# EAGLE design Pulse Oximeter (EAGLE 7.5.0)
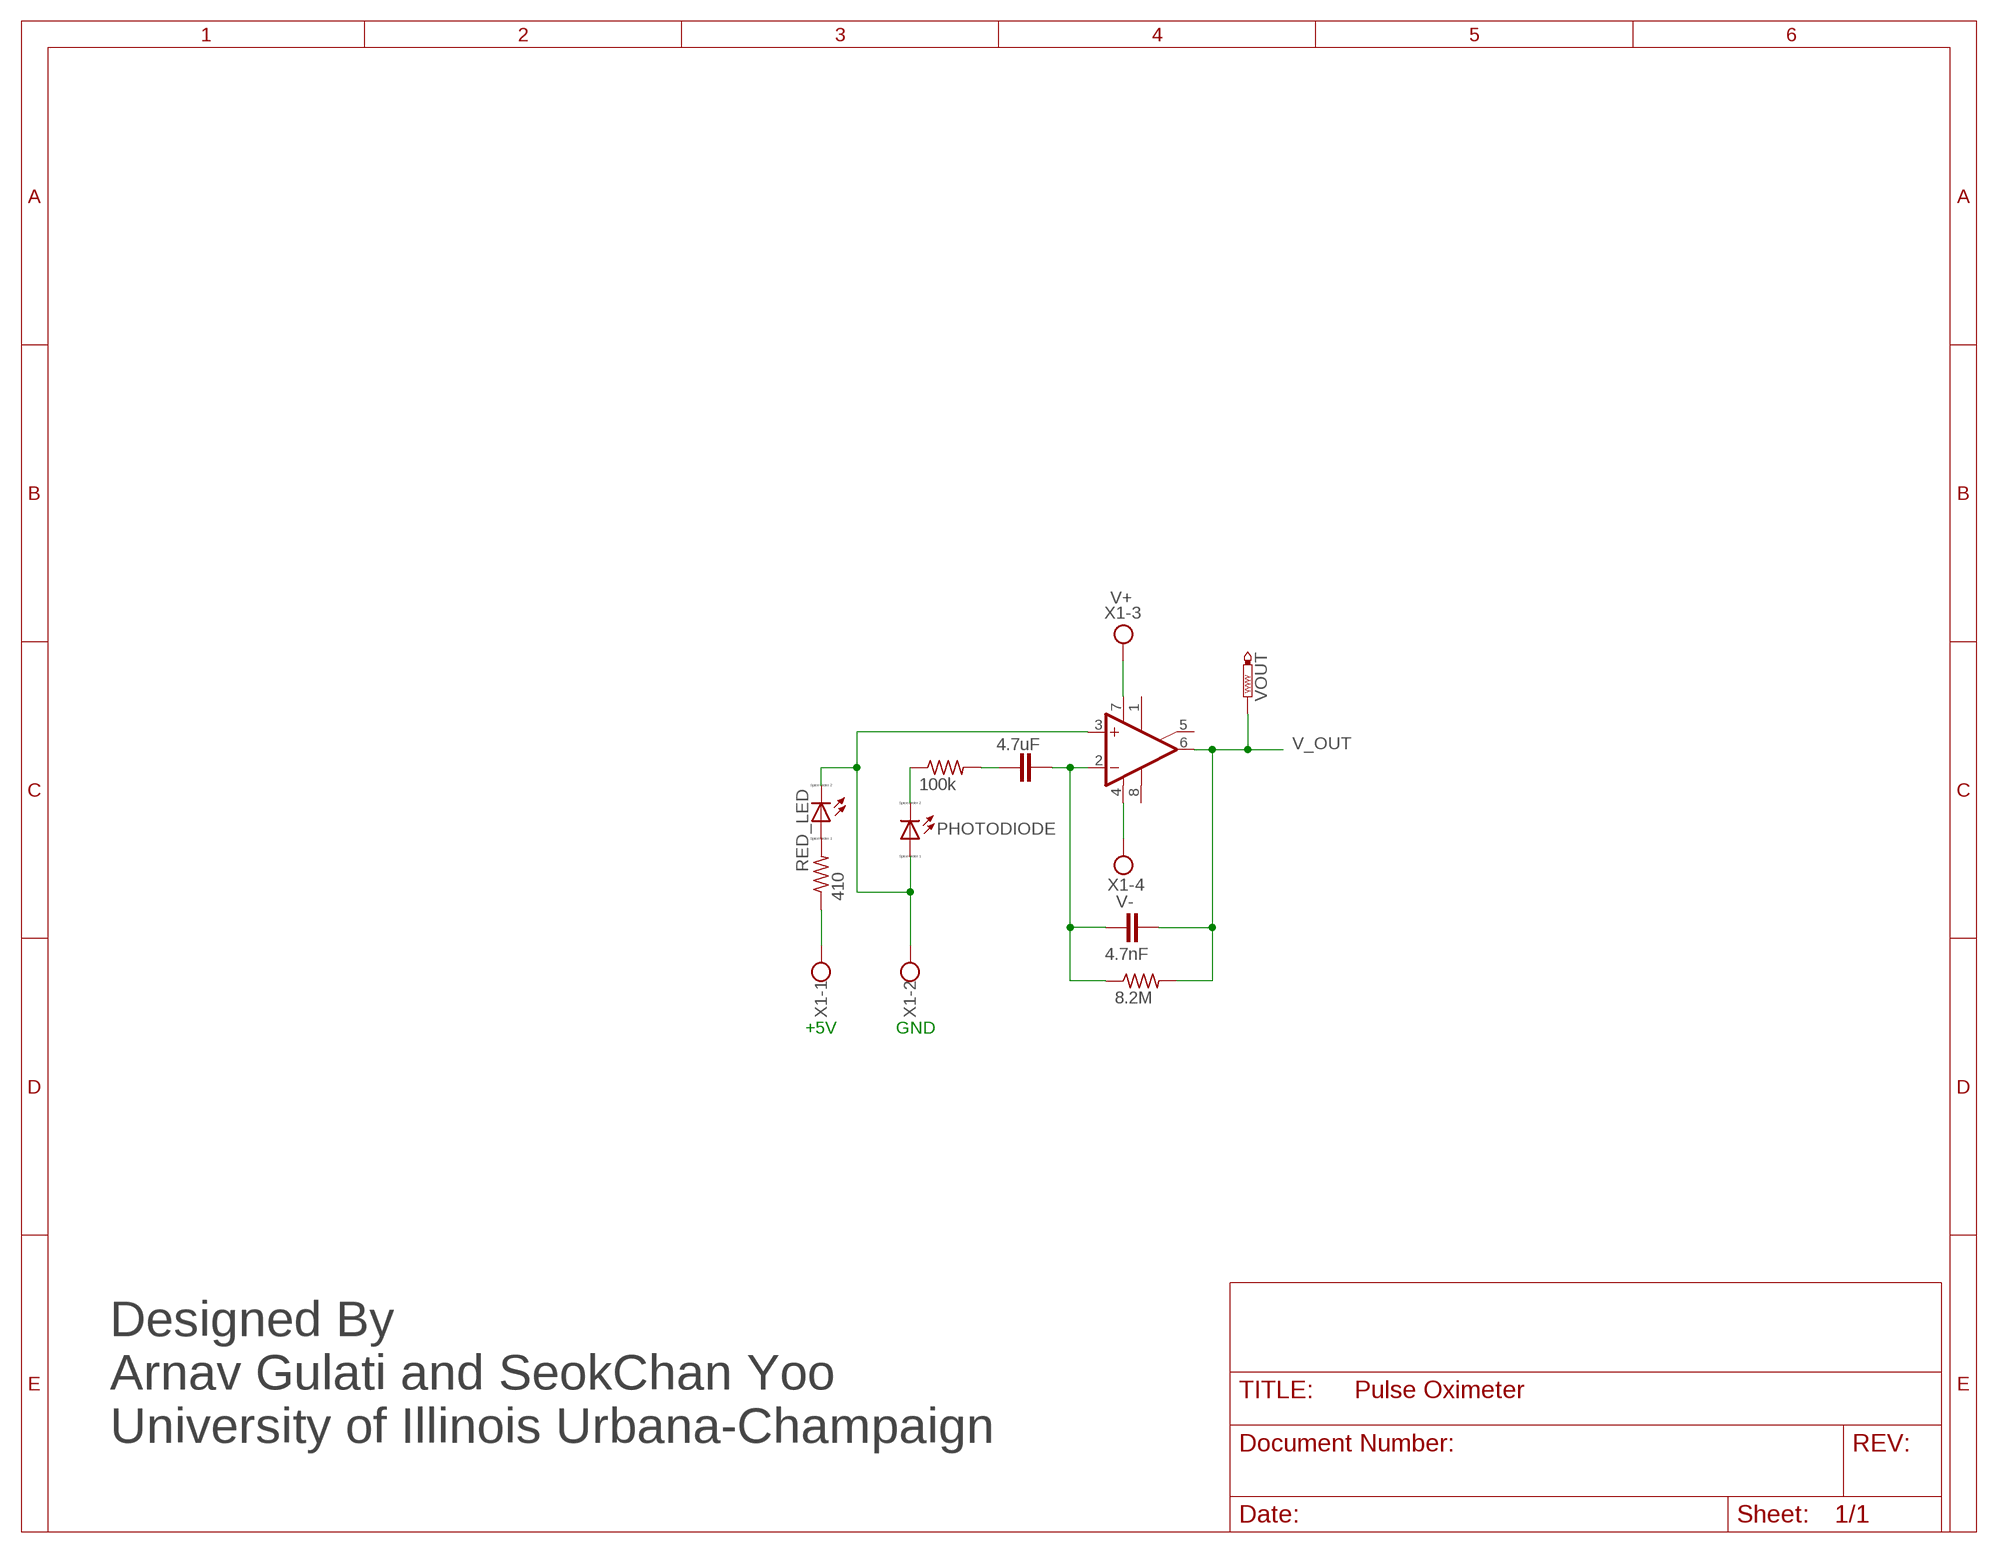
[diagram p0: schematic, sheet 1]
FRAME1 (FRAME_A_L): TITLE: Simple Pulse Oximeter

## Parts
C1  4.7uF  C2,5-3  [C2.5-3]
C2  4.7nF  C2,5-3  [C2.5-3]
IC1  LM741P  [DIL08]
PHOTODIODE  LED_ELD260  [LED_LD260]
R1  100k  R-US_0204/5  [0204/5]
R2  8.2M  R-US_0204/5  [0204/5]
R3  410  R-US_0204/5  [0204/5]
RED_LED  LED_ELD260  [LED_LD260]
VOUT  PTR1PAD1-13  [P1-13]
X1  W237-4  [W237-4]

## Nets
N$1: R3.1 X1.1
N$2: IC1.3(+IN) PHOTODIODE.A RED_LED.K(C) X1.2
N$4: C1.2 C2.1 IC1.2(-IN) R2.1
N$5: C1.1 R1.2
N$6: PHOTODIODE.K(C) R1.1
N$7: R3.2 RED_LED.A
V+: IC1.7(V+) X1.3
V-: IC1.4(V-) X1.4
V_OUT: C2.2 IC1.6(OUT) R2.2 VOUT.TP
Unconnected: IC1.1(ON1) IC1.5(ON2) IC1.8(OPT)

## Notes on the sheet
- +5V | GND
- Designed By
- Arnav Gulati and SeokChan Yoo
- University of Illinois Urbana-Champaign

## Library data of the parts
C1 C2 = capacitor-wima:C: CAPACITOR naming: grid - package width
IC1 = linear:*741: OP AMP
PHOTODIODE RED_LED = eagle-ltspice:LED_E: LED Source: http://www.osram.convergy.de Source: www.luxeon.com Source: www.kingbright.com; SPICEMODEL: NONE; SPICEPREFIX: D; SPICETYPE: diode
R1-R3 = rcl:R-US_: RESISTOR, American symbol
VOUT = testpad:PTR1: TEST PIN
X1 = con-wago-500:W237-4: WAGO SCREW CLAMP; OC_FARNELL: unknown; OC_NEWARK: unknown

## Board
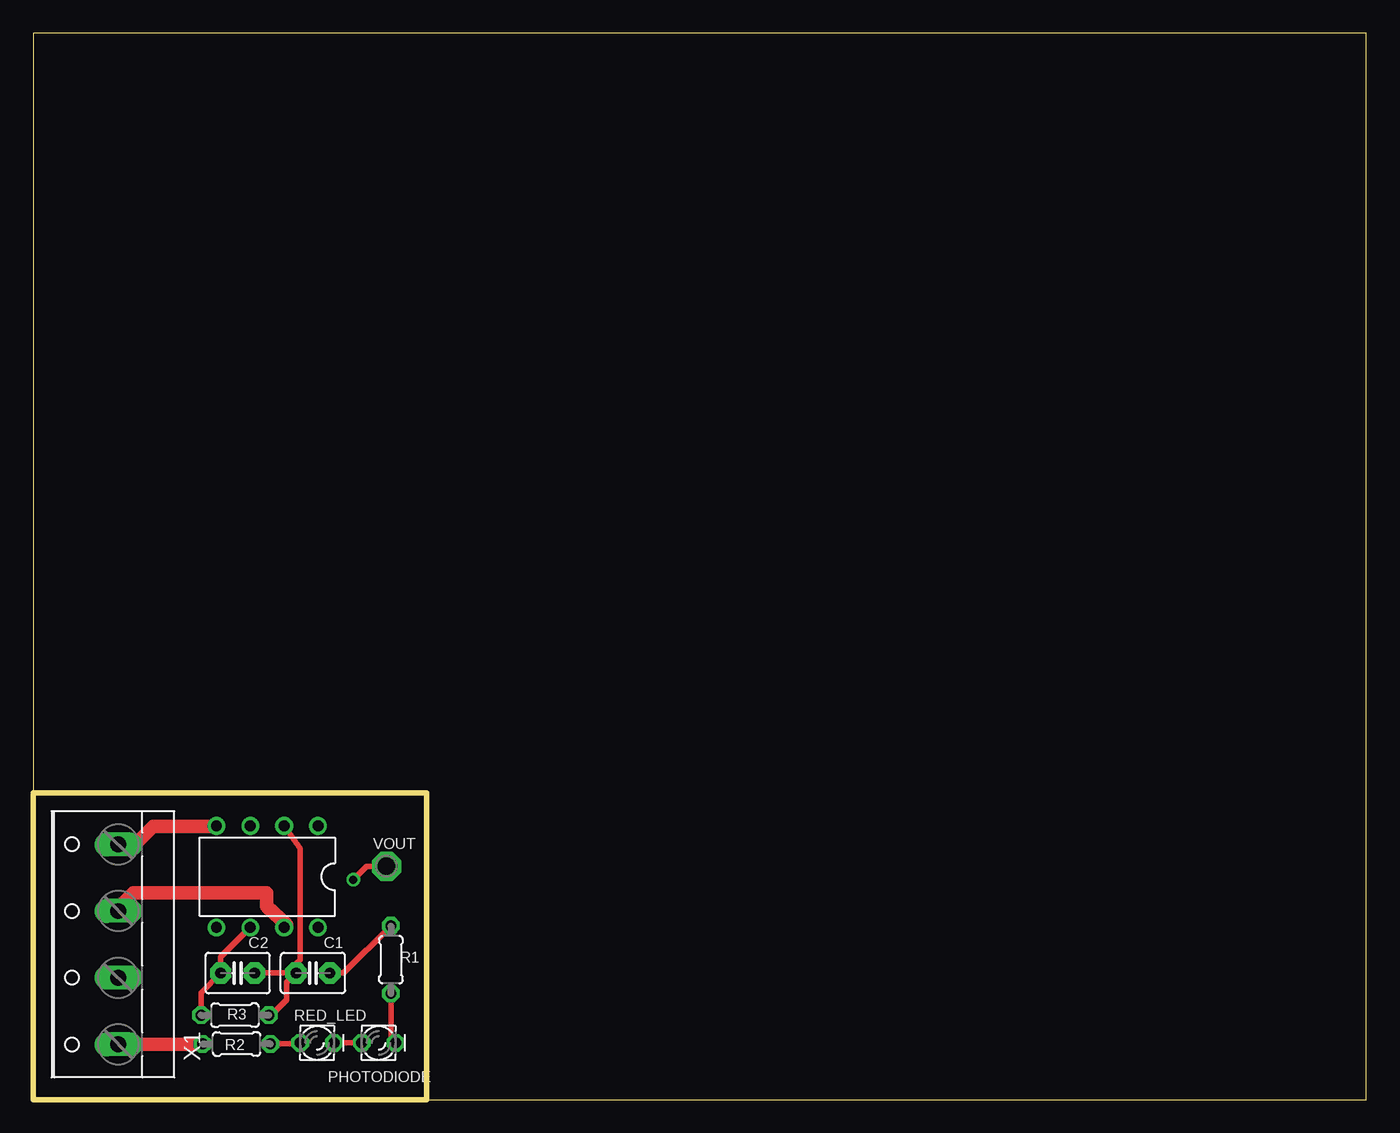
[diagram p1: board, top side]
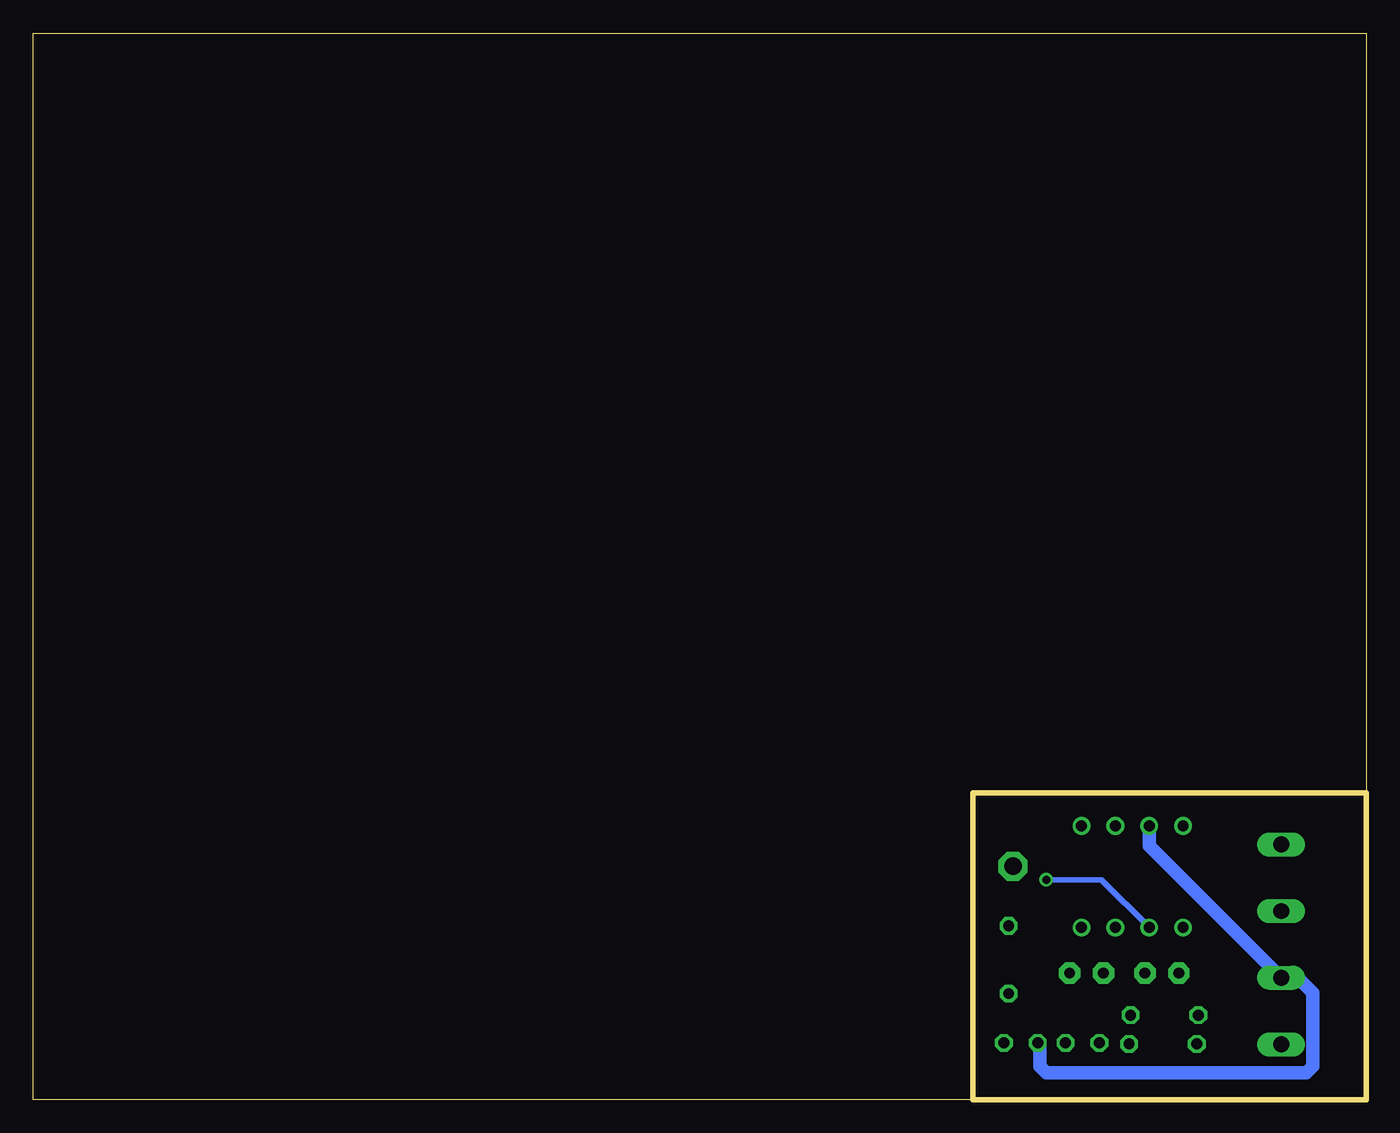
[diagram p2: board, bottom side, seen from below]

Size 100 x 80 mm. Coordinates in mm from the lower left corner, seen from the top.
Outline: 29.5,0 100,0 100,80 0,80 0,23
Outline: 0,23 0,0 29.5,0
Outline: 29.5,0 29.5,23 0,23
Copper layers (1*16): Top 0.035mm / dielectric 1.5mm / Bottom 0.035mm
Design rules "default": minimum track width 10mil, minimum drill 24mil, track to track 8mil, track to pad 8mil, pad to pad 8mil, via to via 8mil, smd to smd 8mil, copper to edge 40mil, drill to drill 8mil, minimum pad ring 10mil, minimum via ring 8mil, stop-mask expansion 4mil, vias tented up to drill 0mil, thermal gap 10mil

### Footprints (pad centres in the part's own frame; a part is rotated, then mirrored left to right if it is on the bottom)
C2.5-3 = drill 0.813 pad 1.6 octagon: 1 -1.27,0; 2 1.27,0
DIL08 = drill 0.813 pad 1.27: 1 -3.81,-3.81; 2 -1.27,-3.81; 3 1.27,-3.81; 4 3.81,-3.81; 5 3.81,3.81; 6 1.27,3.81; 7 -1.27,3.81; 8 -3.81,3.81
LED_LD260 = drill 0.813 octagon: A -1.27,0; K 1.27,0
0204/5 = drill 0.813 octagon: 1 -2.54,0; 2 2.54,0
P1-13 = drill 1.321 pad 2.159 octagon: TP 0,0
W237-4 = drill 1.194 long: 1 -7.5,-1.27; 2 -2.5,-1.27; 3 2.5,-1.27; 4 7.5,-1.27

### Placement (x,y rotation side)
C1  20.98,9.49 180 top
C2  15.33,9.49 180 top
IC1  17.55,16.72 180 top
PHOTODIODE  25.91,4.25 0 top
R1  26.83,10.49 90 top
R2  15.13,6.33 180 top
R3  15.25,4.17 0 top
RED_LED  21.29,4.25 0 top
VOUT  26.5,17.5 0 top
X1  5.11,11.64 90 top

### Tracks (layer width: path | path; a pad name or v marks a point on that pad's centre or on a via)
N$1
  Top 1.016: X1.1 12.68,4.14 R3.1
N$2
  Top 0.406: RED_LED.K PHOTODIODE.A
  Bottom 1.016: IC1.3 16.28,19.04 X1.2 5.14,9.14 4,8 4,2.5 4.5,2 24,2 24.5,2.5 24.5,4.11 PHOTODIODE.A
N$4
  Top 0.406: C2.1 C1.2 | R2.1 17.83,6.33 19,7.5 19,8.78 C1.2 | C1.2 19.71,10.21 20,10.5 20,18.85 IC1.2
N$5
  Top 0.406: C1.1 23.29,9.49 R1.2
N$6
  Top 0.406: R1.1 26.83,4.6 PHOTODIODE.K
N$7
  Top 0.406: R3.2 19.94,4.17 RED_LED.A
V+
  Top 1.016: X1.3 6.38,14.38 7.5,15.5 17.5,15.5 17.5,14.5 19,13.09 IC1.7
V-
  Top 1.016: X1.4 7.64,19.14 9,20.5 13.71,20.5 IC1.4
V_OUT  (via drill 0.6)
  Top 0.406: VOUT.TP 25,17.5 v24,16.5 | R2.2 12.59,8.02 C2.2 14.06,10.69 IC1.6
  Bottom 0.406: v24,16.5 19.87,16.5 IC1.6

### Text on the board
Name: openBioinstrumentation